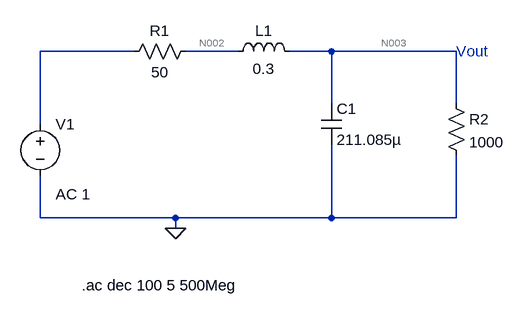
[diagram p0: schematic LC_filter.asc]
LC_filter.asc, the LTspice schematic file:
Version 4
SHEET 1 880 680
WIRE -32 -32 -176 -32
WIRE 128 -32 48 -32
WIRE 272 -32 208 -32
WIRE 464 -32 272 -32
WIRE 272 48 272 -32
WIRE 464 48 464 -32
WIRE -176 80 -176 -32
WIRE -176 224 -176 160
WIRE 32 224 -176 224
WIRE 272 224 272 112
WIRE 272 224 32 224
WIRE 464 224 464 128
WIRE 464 224 272 224
WIRE 32 240 32 224
FLAG 32 240 0
SYMBOL res 64 -48 R90
WINDOW 0 0 56 VBottom 2
WINDOW 3 32 56 VTop 2
SYMATTR InstName R1
SYMATTR Value 50
SYMBOL res 448 32 R0
SYMATTR InstName R2
SYMATTR Value 1000
SYMBOL voltage -176 64 R0
WINDOW 123 24 124 Left 2
WINDOW 39 0 0 Left 0
SYMATTR InstName V1
SYMATTR Value ""
SYMATTR Value2 AC 1
SYMBOL cap 256 48 R0
SYMATTR InstName C1
SYMATTR Value 211.085µ
SYMBOL ind 112 -16 R270
WINDOW 0 32 56 VTop 2
WINDOW 3 5 56 VBottom 2
SYMATTR InstName L1
SYMATTR Value 0.3
TEXT 464 -32 Left 2 ;Vout
TEXT -112 328 Left 2 !.ac dec 100 5 500Meg

The netlist it stands for:
* LC_filter.asc
R1 N002 N001 50
R2 N003 0 1000
V1 N001 0 AC 1
C1 N003 0 211.085µ
L1 N002 N003 0.3
* Vout
.ac dec 100 5 500Meg
.backanno
.end

* Results of the author's LTspice run, read from the files saved beside the schematic
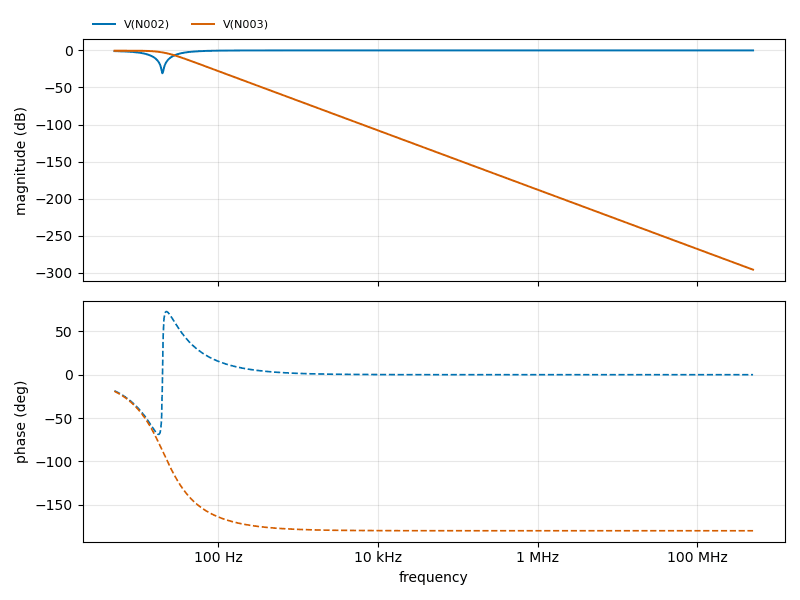
[diagram p1: AC Analysis of LC_filter.asc, plotted from the saved traces]
* AC Analysis, 1 run:
*   V(N002): -0.94 dB at 5 Hz, -0.00 dB at 500 MHz, peak -0.00 dB at 500 MHz, 3 dB below the peak at 37.43 Hz
*   V(N003): -0.38 dB at 5 Hz, -295.92 dB at 500 MHz, peak -0.37 dB at 6.902 Hz, 3 dB below the peak at 21.56 Hz